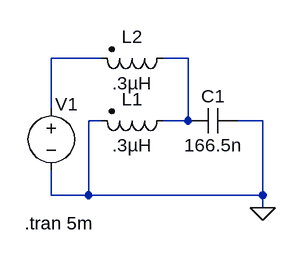
[diagram p0: schematic tank_beautiful.asc]
tank_beautiful.asc, the LTspice schematic file:
Version 4
SHEET 1 880 680
WIRE 176 64 112 64
WIRE 288 64 256 64
WIRE 112 128 112 64
WIRE 176 144 160 144
WIRE 288 144 288 64
WIRE 288 144 256 144
WIRE 384 144 352 144
WIRE 112 240 112 208
WIRE 160 240 160 144
WIRE 160 240 112 240
WIRE 384 240 384 144
WIRE 384 240 160 240
WIRE 384 256 384 240
FLAG 384 256 0
SYMBOL voltage 112 112 R0
WINDOW 3 70 -3 Invisible 2
WINDOW 123 0 0 Left 2
WINDOW 39 0 0 Left 2
WINDOW 0 5 11 Left 2
SYMATTR Value SINE(0 1 1Meg 0 0 0)
SYMATTR InstName V1
SYMBOL ind2 272 128 R90
WINDOW 0 4 56 VBottom 2
WINDOW 3 32 56 VTop 2
SYMATTR InstName L1
SYMATTR Value .3µH
SYMATTR Type ind
SYMBOL Misc\\EuropeanCap 352 128 R90
WINDOW 0 0 32 VBottom 2
WINDOW 3 32 32 VTop 2
SYMATTR InstName C1
SYMATTR Value 166.5n
SYMBOL ind2 272 48 R90
WINDOW 0 4 56 VBottom 2
WINDOW 3 32 56 VTop 2
SYMATTR InstName L2
SYMATTR Value .3µH
SYMATTR Type ind
TEXT 78 276 Left 2 !.tran 5m

The netlist it stands for:
* tank_beautiful.asc
V1 N001 0 SINE(0 1 1Meg 0 0 0)
L1 N002 0 .3µH
C1 0 N002 166.5n
L2 N002 N001 .3µH
.tran 5m
.backanno
.end